# EAGLE design rgbpong (EAGLE 9.3.2)
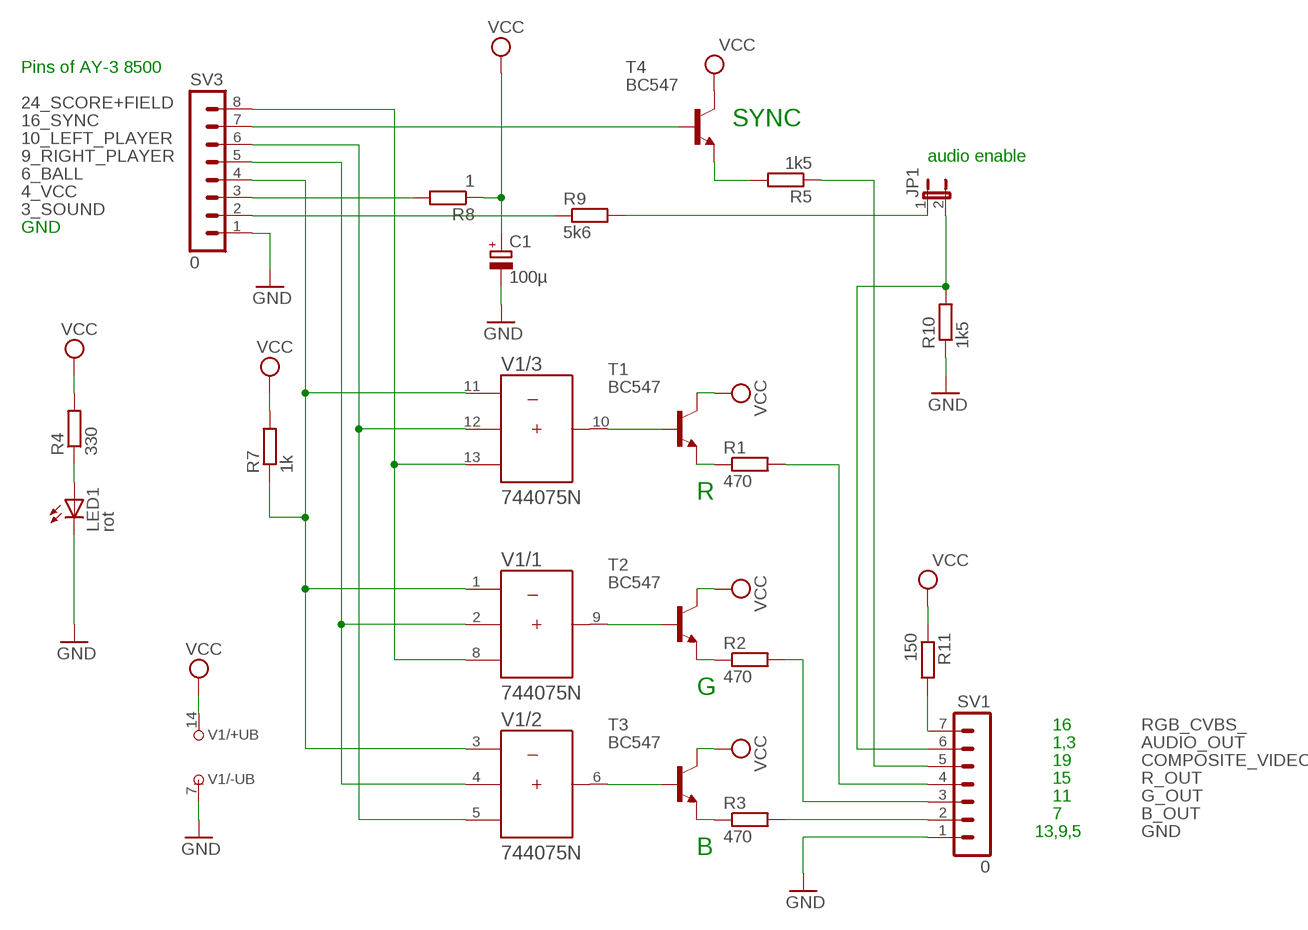
[diagram p0: schematic, sheet 1]

## Parts
C1  100µ  CPOL-EUE2.5-5  [E2,5-5]
JP1  0  JP1E  [JP1]
LED1  rot  LED3MM  [LED3MM]
R1  470  R-EU_0207/10  [0207/10]
R2  470  R-EU_0207/10  [0207/10]
R3  470  R-EU_0207/10  [0207/10]
R4  330  R-EU_0207/10  [0207/10]
R5  1k5  R-EU_0207/10  [0207/10]
R7  1k  R-EU_0207/15  [0207/15]
R8  1  R-EU_0207/15  [0207/15]
R9  5k6  R-EU_0207/10  [0207/10]
R10  1k5  R-EU_0207/10  [0207/10]
R11  150  R-EU_0207/10  [0207/10]
SV1  0  MA07-1  [MA07-1]
SV3  0  MA08-1  [MA08-1]
T1  BC547  -NPN-TO92-ECB  [TO92-ECB]
T2  BC547  -NPN-TO92-ECB  [TO92-ECB]
T3  BC547  -NPN-TO92-ECB  [TO92-ECB]
T4  BC547  -NPN-TO92-ECB  [TO92-ECB]
V1  744075N  [DIL14]

## Nets
3_SOUND: R9.1 SV3.2
4_VCC: R8.2 SV3.3
6_BALL: R7.1 SV3.4 V1.1(/1:A) V1.3(/2:A) V1.11(/3:A)
9_RIGHT_PLAYER: SV3.5 V1.2(/1:B) V1.4(/2:B)
10_LEFT_PLAYER: SV3.6 V1.5(/2:C) V1.12(/3:B)
16_SYNC: SV3.7 T4.B
24_SCORE+FIELD: SV3.8 V1.8(/1:C) V1.13(/3:C)
AUDIO_OUT: JP1.2 R10.2 SV1.6
B_OUT: R3.2 SV1.2
B_TTL: T3.B V1.6(/2:Y)
COMPOSITE_VIDEO: R5.1 SV1.5
G_OUT: R2.2 SV1.3
G_TTL: T2.B V1.9(/1:Y)
GND: C1.- LED1.K(C) R10.1 SV1.1 SV3.1 V1.7(/-UB:-UB)
N$1: LED1.A R4.1
N$2: R5.2 T4.E
N$6: R1.1 T1.E
N$7: R2.1 T2.E
N$21: R3.1 T3.E
N$23: JP1.1 R9.2
R_OUT: R1.2 SV1.4
R_TTL: T1.B V1.10(/3:Y)
RGB_CVBS_: R11.2 SV1.7
VCC: C1.+ R4.2 R7.2 R8.1 R11.1 T1.C T2.C T3.C T4.C V1.14(/+UB:+UB)

## Notes on the sheet
- Pins of AY-3 8500
- SYNC
- audio enable
- R
- G
- 16
- 1,3
- 19
- 15
- 11
- 7
- 13,9,5
- B

## Library data of the parts
C1 = rcl:CPOL-EU: POLARIZED CAPACITOR, European symbol
JP1 = jumper:JP1E: JUMPER
LED1 = led:LED: LED OSRAM: - CHIPLED LG R971, LG N971, LY N971, LG Q971, LY Q971, LO R971, LY R971 LH N974, LH R974 LS Q976, LO Q976, LY Q976 LO Q996 - Hyper CHIPLED LW Q18S LB Q993, LB Q99A, LB R99A - SideLED LS A670, LO A670, LY A670, LG A670, LP A670 LB A673, LV A673, LT A673, LW A673 LH A674 LY A675 LS A676, LA A676, LO A676, LY A676, LW A676 LS A679, LY A679, LG A679 - Hyper Micro SIDELED® LS Y876, LA Y876, LO Y876, LY Y876 LT Y87S - SmartLED LW L88C, LW L88S LB L89C, LB L89S, LG L890 LS L89K, LO L89K, LY L89K LS L896, LA L896, LO L896, LY L896 - TOPLED LS T670, LO T670, LY T670, LG T670, LP T670 LSG T670, LSP T670, LSY T670, LOP T670, LYG T670 LG T671, LOG T671, LSG T671 LB T673, LV T673, LT T673, LW T673 LH T674 LS T676, LA T676, LO T676, LY T676, LB T676, LH T676, LSB T676, LW T676 LB T67C, LV T67C, LT T67C, LS T67K, LO T67K, LY T67K, LW E67C LS E67B, LA E67B, LO E67B, LY E67B, LB E67C, LV E67C, LT E67C LW T67C LS T679, LY T679, LG T679 LS T770, LO T770, LY T770, LG T770, LP T770 LB T773, LV T773, LT T773, LW T773 LH T774 LS E675, LA E675, LY E675, LS T675 LS T776, LA T776, LO T776, LY T776, LB T776 LHGB T686 LT T68C, LB T68C - Hyper Mini TOPLED® LB M676 - Mini TOPLED Santana® LG M470 LS M47K, LO M47K, LY M47K Source: http://www.osram.convergy.de LUXEON: - LUMILED® LXK2-PW12-R00, LXK2-PW12-S00, LXK2-PW14-U00, LXK2-PW14-V00 LXK2-PM12-R00, LXK2-PM12-S00, LXK2-PM14-U00 LXK2-PE12-Q00, LXK2-PE12-R00, LXK2-PE12-S00, LXK2-PE14-T00, LXK2-PE14-U00 LXK2-PB12-K00, LXK2-PB12-L00, LXK2-PB12-M00, LXK2-PB14-N00, LXK2-PB14-P00, LXK2-PB14-Q00 LXK2-PR12-L00, LXK2-PR12-M00, LXK2-PR14-Q00, LXK2-PR14-R00 LXK2-PD12-Q00, LXK2-PD12-R00, LXK2-PD12-S00 LXK2-PH12-R00, LXK2-PH12-S00 LXK2-PL12-P00, LXK2-PL12-Q00, LXK2-PL12-R00 Source: www.luxeon.com KINGBRIGHT: KA-3528ASYC Source: www.kingbright.com
R1-R5 R7-R11 = rcl:R-EU_: RESISTOR, European symbol
SV1 = con-lstb:MA07-1: PIN HEADER; OC_FARNELL: unknown; OC_NEWARK: unknown
SV3 = con-lstb:MA08-1: PIN HEADER; OC_FARNELL: unknown; OC_NEWARK: unknown
T1-T4 = transistor:*-NPN-: NPN Transistror BF959 corrected 2008.03.06
V1 = 74ttl-din:74*4075: Triple 3-input OR

## Board
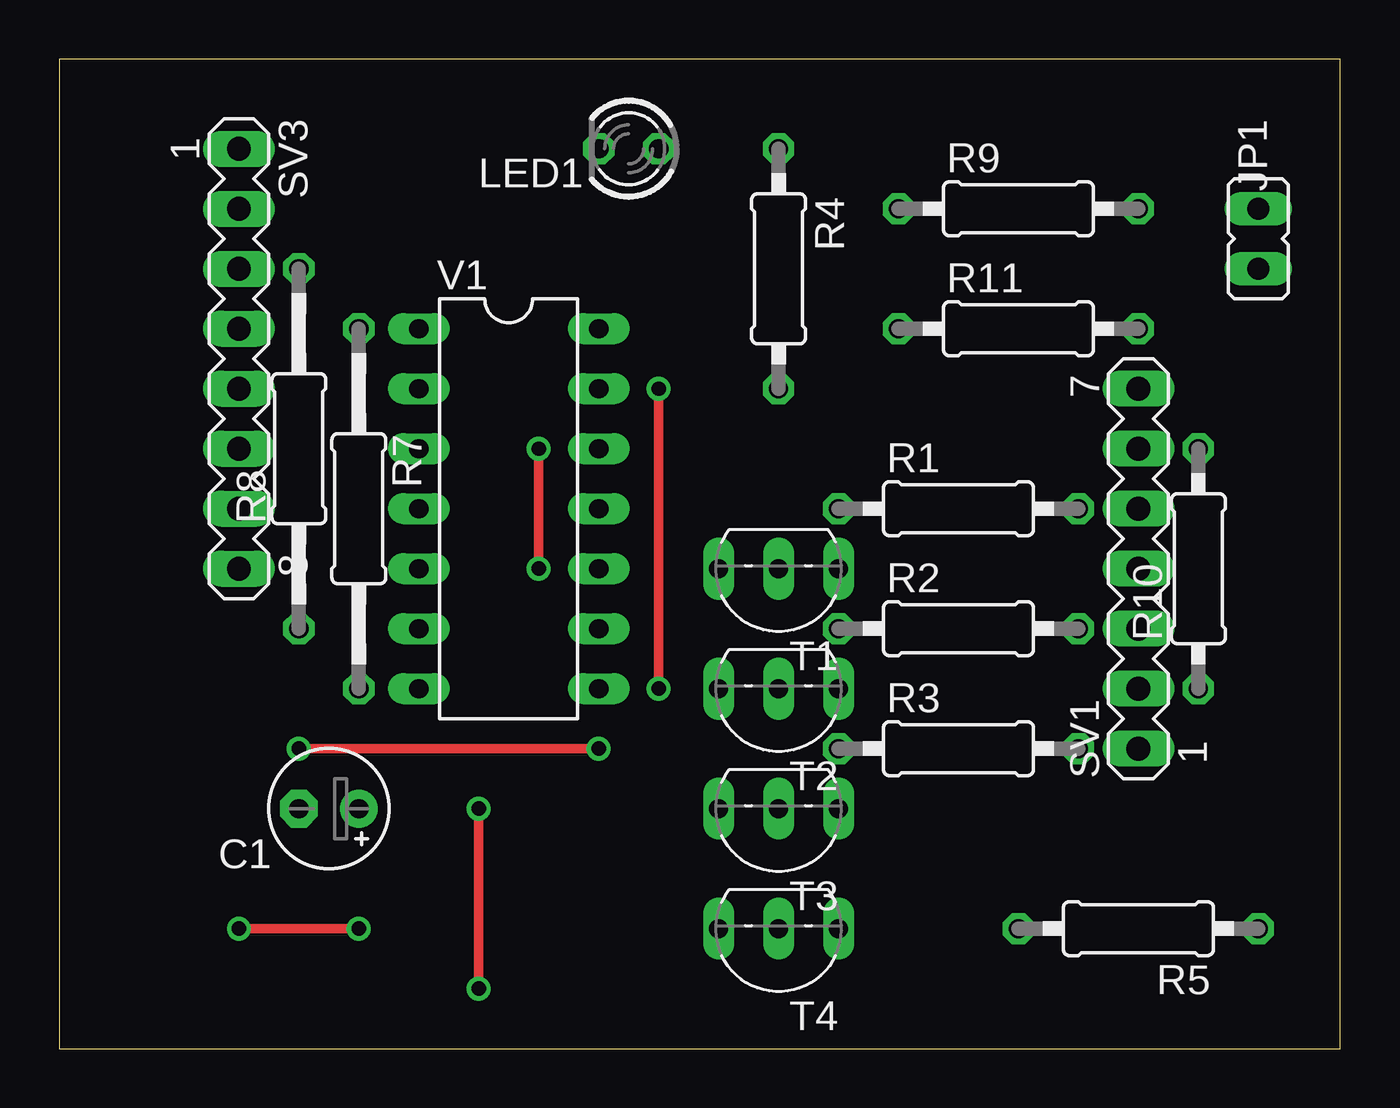
[diagram p1: board, top side]
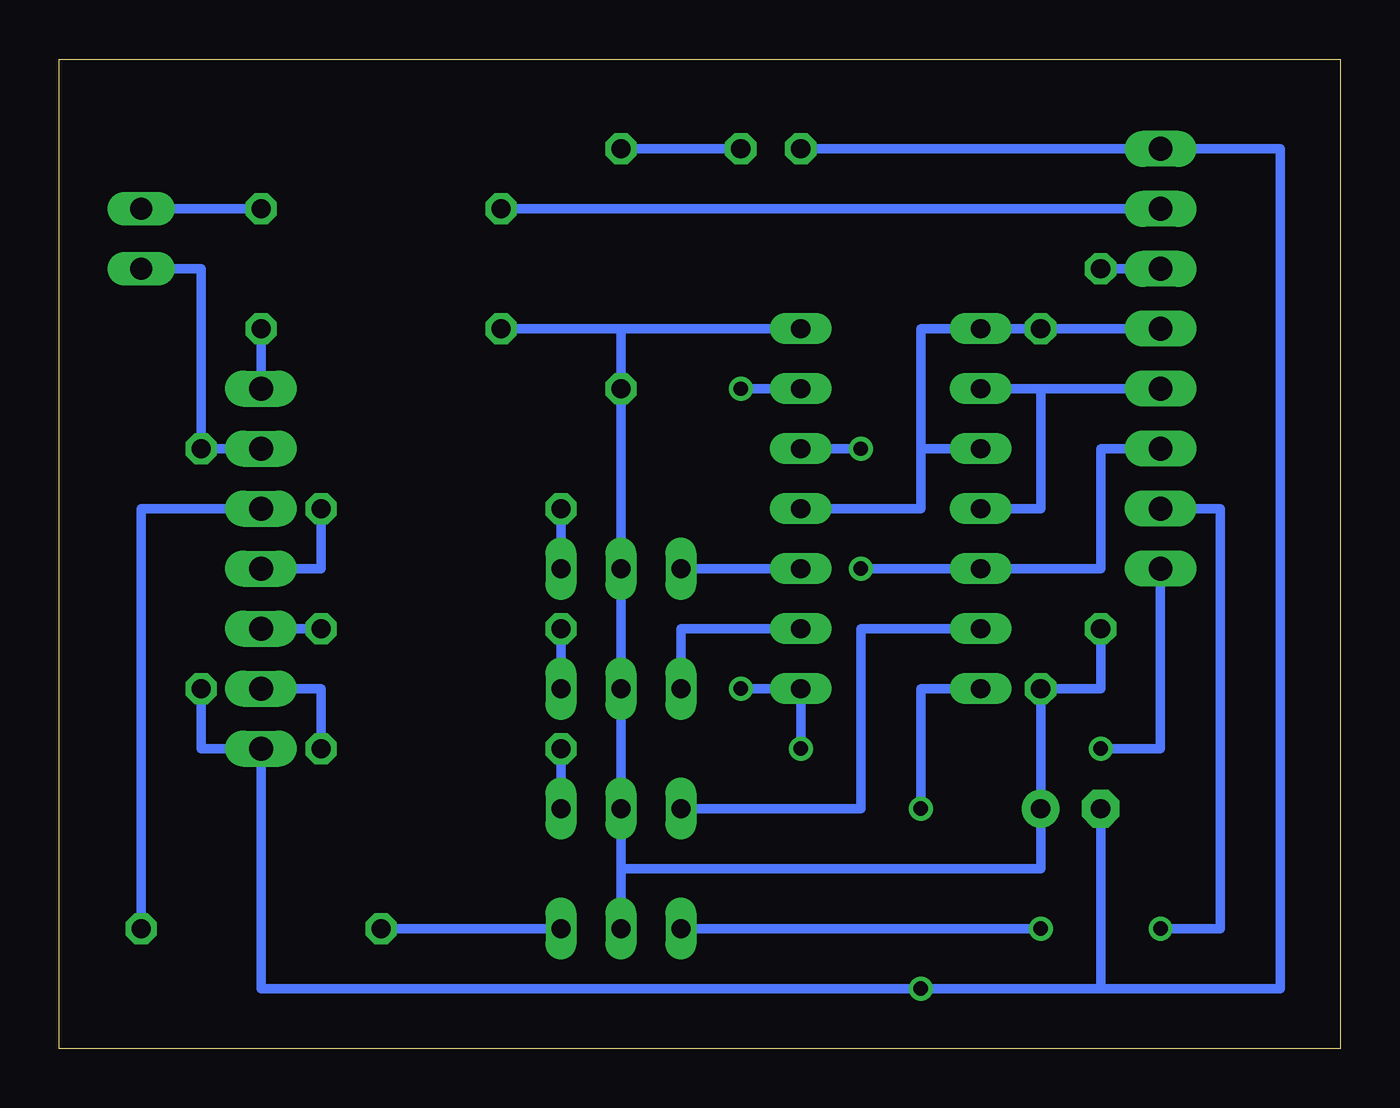
[diagram p2: board, bottom side, seen from below]

Size 54.28 x 41.9 mm. Coordinates in mm from the lower left corner, seen from the top.
Outline: 0,0 54.28,0 54.28,41.9 0,41.9 0,0
Copper layers (1*16): Top 0.035mm / dielectric 1.5mm / Bottom 0.035mm
Design rules "default": minimum track width 10mil, minimum drill 24mil, track to track 8mil, track to pad 8mil, pad to pad 8mil, via to via 8mil, smd to smd 8mil, copper to edge 40mil, drill to drill 8mil, minimum pad ring 10mil, minimum via ring 8mil, stop-mask expansion 4mil, vias tented up to drill 0mil, thermal gap 10mil

### Footprints (pad centres in the part's own frame; a part is rotated, then mirrored left to right if it is on the bottom)
E2,5-5 = drill 0.813 pad 1.6: + -1.27,0 | drill 0.813 pad 1.6 octagon: - 1.27,0
JP1 = drill 0.914 long: 1 0,-1.27; 2 0,1.27
LED3MM = drill 0.813 octagon: A -1.27,0; K 1.27,0
0207/10 = drill 0.813 octagon: 1 -5.08,0; 2 5.08,0
0207/15 = drill 0.813 octagon: 1 -7.62,0; 2 7.62,0
MA07-1 = drill 1.016 long: 1 -7.62,0; 2 -5.08,0; 3 -2.54,0; 4 0,0; 5 2.54,0; 6 5.08,0; 7 7.62,0
MA08-1 = drill 1.016 long: 1 -8.89,0; 2 -6.35,0; 3 -3.81,0; 4 -1.27,0; 5 1.27,0; 6 3.81,0; 7 6.35,0; 8 8.89,0
TO92-ECB = drill 0.813 long: B 2.54,0; C 0,0; E -2.54,0
DIL14 = drill 0.813 long: 1 -7.62,-3.81; 2 -5.08,-3.81; 3 -2.54,-3.81; 4 0,-3.81; 5 2.54,-3.81; 6 5.08,-3.81; 7 7.62,-3.81; 8 7.62,3.81; 9 5.08,3.81; 10 2.54,3.81; 11 0,3.81; 12 -2.54,3.81; 13 -5.08,3.81; 14 -7.62,3.81

### Placement (x,y rotation side)
C1  11.43,10.16 180 top
JP1  50.8,34.29 180 top
LED1  24.13,38.1 180 top
R1  38.1,22.86 0 top
R2  38.1,17.78 0 top
R3  38.1,12.7 0 top
R4  30.48,33.02 270 top
R5  45.72,5.08 180 top
R7  12.7,22.86 270 top
R8  10.16,25.4 90 top
R9  40.64,35.56 0 top
R10  48.26,20.32 90 top
R11  40.64,30.48 0 top
SV1  45.72,20.32 90 top
SV3  7.62,29.21 270 top
T1  30.48,20.32 180 top
T2  30.48,15.24 180 top
T3  30.48,10.16 180 top
T4  30.48,5.08 180 top
V1  19.05,22.86 270 top

### Tracks (layer width: path | path; a pad name or v marks a point on that pad's centre or on a via)
3_SOUND
  Bottom 0.406: SV3.2 R9.1
4_VCC
  Bottom 0.406: SV3.3 R8.2
6_BALL
  Bottom 0.406: V1.3 17.78,25.4 | 17.78,25.4 17.78,22.86 V1.11 | 17.78,25.4 17.78,30.48 V1.1 R7.1 SV3.4
9_RIGHT_PLAYER
  Bottom 0.406: V1.4 12.7,22.86 12.7,27.94 | 12.7,27.94 V1.2 | SV3.5 12.7,27.94
10_LEFT_PLAYER  (via drill 0.61 pad 0.85)
  Top 0.406: v20.32,20.32 v20.32,25.4
  Bottom 0.406: v20.32,20.32 V1.5 10.16,20.32 10.16,25.4 SV3.6 | V1.12 v20.32,25.4
16_SYNC  (via drill 0.61 pad 0.85)
  Top 0.406: v7.62,5.08 v12.7,5.08
  Bottom 0.406: SV3.7 5.08,22.86 5.08,5.08 v7.62,5.08 | T4.B v12.7,5.08
24_SCORE+FIELD  (via drill 0.61 pad 0.85)
  Top 0.406: v25.4,15.24 v25.4,27.94 | v22.86,12.7 v10.16,12.7
  Bottom 0.406: v25.4,15.24 V1.8 v22.86,12.7 | V1.13 v25.4,27.94 | SV3.8 7.62,12.7 v10.16,12.7
AUDIO_OUT
  Bottom 0.406: JP1.2 48.26,33.02 R10.2 SV1.6
B_OUT
  Bottom 0.406: SV1.2 43.18,15.24 R3.2
B_TTL
  Bottom 0.406: V1.6 20.32,17.78 20.32,10.16 T3.B
COMPOSITE_VIDEO
  Bottom 0.406: SV1.5 50.8,22.86 R5.1
G_OUT
  Bottom 0.406: R2.2 SV1.3
G_TTL
  Bottom 0.406: V1.9 27.94,17.78 T2.B
GND  (via drill 0.61 pad 0.85)
  Top 0.406: v17.78,10.16 v17.78,2.54
  Bottom 0.406: R10.1 48.26,12.7 SV1.1 45.72,2.54 v17.78,2.54 10.16,2.54 | C1.- 10.16,2.54 | V1.7 17.78,15.24 v17.78,10.16 | LED1.K SV3.1 2.54,38.1 2.54,2.54 10.16,2.54
N$1
  Bottom 0.406: R4.1 LED1.A
N$2
  Bottom 0.406: T4.E R5.2
N$6
  Bottom 0.406: T1.E R1.1
N$7
  Bottom 0.406: T2.E R2.1
N$21
  Bottom 0.406: T3.E R3.1
N$23
  Bottom 0.406: R9.2 JP1.1
R_OUT
  Bottom 0.406: SV1.4 43.18,20.32 R1.2
R_TTL
  Bottom 0.406: V1.10 T1.B
RGB_CVBS_
  Bottom 0.406: R11.2 SV1.7
VCC
  Bottom 0.406: 30.48,7.62 12.7,7.62 C1.+ R7.2 10.16,15.24 R8.1 | 30.48,30.48 V1.14 | 30.48,7.62 T3.C T2.C T1.C R4.2 30.48,30.48 | R11.1 30.48,30.48 | T4.C 30.48,7.62